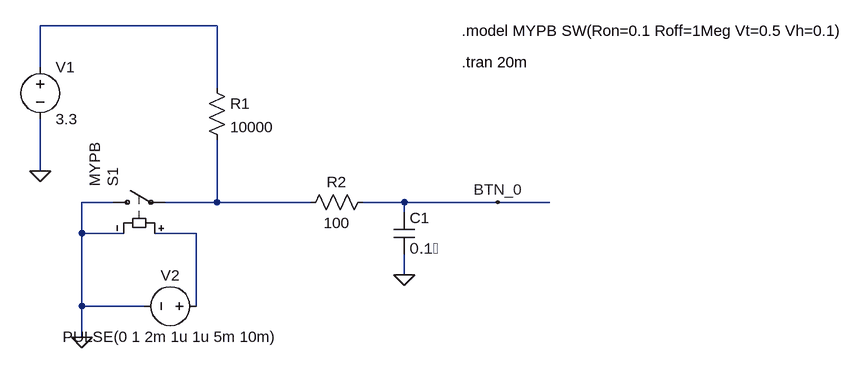
[diagram p0: schematic CalorieTracker_BTN0_LTSPICE.asc]
CalorieTracker_BTN0_LTSPICE.asc, the LTspice schematic file:
Version 4.1
SHEET 1 1124 680
WIRE 112 16 -160 16
WIRE -160 80 -160 16
WIRE 112 112 112 16
WIRE -160 240 -160 160
WIRE -48 288 -96 288
WIRE 112 288 112 192
WIRE 112 288 32 288
WIRE 256 288 112 288
WIRE 400 288 336 288
WIRE 544 288 400 288
WIRE 624 288 544 288
WIRE 400 304 400 288
WIRE -96 336 -96 288
WIRE -32 336 -96 336
WIRE 80 336 16 336
WIRE 400 400 400 368
WIRE -96 448 -96 336
WIRE 0 448 -96 448
WIRE 80 448 80 336
WIRE -96 496 -96 448
FLAG -160 240 0
FLAG 400 400 0
FLAG 544 288 BTN_0
FLAG -96 496 0
SYMBOL voltage -160 64 R0
WINDOW 123 0 0 Left 0
WINDOW 39 0 0 Left 0
SYMATTR InstName V1
SYMATTR Value 3.3
SYMBOL sw -64 288 R270
WINDOW 3 24 -12 Left 2
SYMATTR InstName S1
SYMATTR Value MYPB
SYMBOL res 96 96 R0
SYMATTR InstName R1
SYMATTR Value 10000
SYMATTR SpiceLine tol=1 pwr=63m
SYMBOL res 352 272 R90
WINDOW 0 0 56 VBottom 2
WINDOW 3 32 56 VTop 2
SYMATTR InstName R2
SYMATTR Value 100
SYMATTR SpiceLine tol=1 pwr=63m
SYMBOL cap 384 304 R0
SYMATTR InstName C1
SYMATTR Value 0.1�
SYMATTR SpiceLine V=16 Irms=0 Rser=0.038 Lser=800p mfg="W�rth Elektronik" pn="885012104001 WCAP-CSGP 0201" type="X5R"
SYMBOL voltage 96 448 R90
WINDOW 0 -32 56 VBottom 2
WINDOW 3 32 56 VTop 2
WINDOW 123 0 0 Left 0
WINDOW 39 0 0 Left 0
SYMATTR InstName V2
SYMATTR Value PULSE(0 1 2m 1u 1u 5m 10m)
TEXT 488 24 Left 2 !.model MYPB SW(Ron=0.1 Roff=1Meg Vt=0.5 Vh=0.1)
TEXT 488 72 Left 2 !.tran 20m

The netlist it stands for:
* CalorieTracker_BTN0_LTSPICE.asc
V1 N001 0 3.3
S1 0 N002 N003 0 MYPB
R1 N001 N002 10000 tol=1 pwr=63m
R2 BTN_0 N002 100 tol=1 pwr=63m
C1 BTN_0 0 0.1� V=16 Irms=0 Rser=0.038 Lser=800p mfg="W�rth Elektronik" pn="885012104001 WCAP-CSGP 0201" type="X5R"
V2 N003 0 PULSE(0 1 2m 1u 1u 5m 10m)
.model MYPB SW(Ron=0.1 Roff=1Meg Vt=0.5 Vh=0.1)
.tran 20m
.backanno
.end